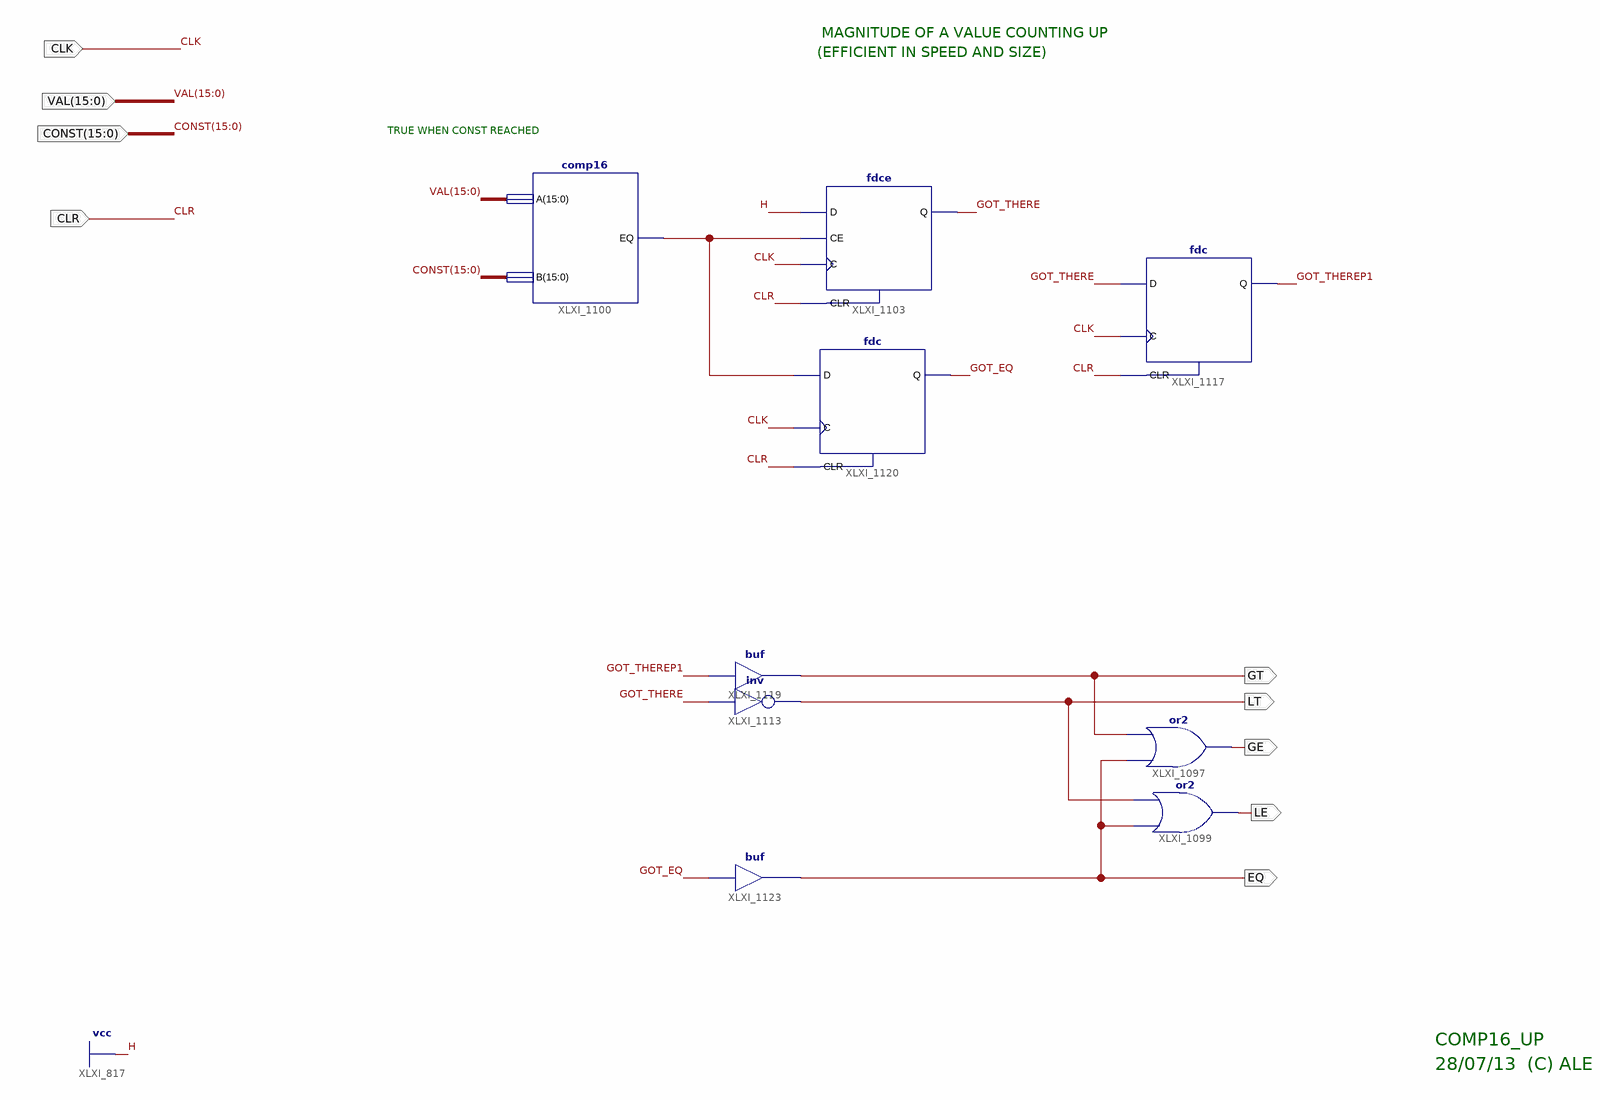
[diagram p0: schematic sheet 1]
// Xilinx ISE schematic DB_Comp16_up.sch (spartan3e) as structural Verilog: 9 symbols, 9 ports
module DB_Comp16_up (
  input  [15:0] VAL,
  input  [15:0] CONST,
  input  CLR,
  input  CLK,
  output LT,
  output EQ,
  output GE,
  output LE,
  output GT
);

  wire GOT_EQ, GOT_THERE, GOT_THEREP1, XLXN_56;

  or XLXI_1097 (GE, EQ, GT);
  or XLXI_1099 (LE, EQ, LT);
  not XLXI_1113 (LT, GOT_THERE);
  buf XLXI_1119 (GT, GOT_THEREP1);
  buf XLXI_1123 (EQ, GOT_EQ);
  comp16 XLXI_1100 (.A(VAL), .B(CONST), .EQ(XLXN_56));
  fdce XLXI_1103 (.C(CLK), .CE(XLXN_56), .CLR(CLR), .D(1'b1), .Q(GOT_THERE));
  fdc XLXI_1117 (.C(CLK), .CLR(CLR), .D(GOT_THERE), .Q(GOT_THEREP1));
  fdc XLXI_1120 (.C(CLK), .CLR(CLR), .D(XLXN_56), .Q(GOT_EQ));

  // Notes on the sheet:
  //   MAGNITUDE OF A VALUE COUNTING UP
  //   (EFFICIENT IN SPEED AND SIZE)
  //   TRUE WHEN CONST REACHED
  //   COMP16_UP
  //   28/07/13  (C) ALE
endmodule
